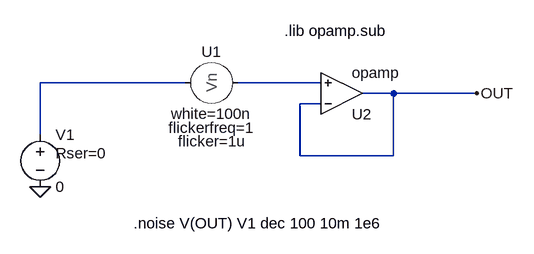
[diagram p0: schematic example_vnoise.asc]
example_vnoise.asc, the LTspice schematic file:
Version 4
SHEET 1 4300 1232
WIRE 1632 -1632 1408 -1632
WIRE 1840 -1632 1712 -1632
WIRE 1952 -1616 1904 -1616
WIRE 2080 -1616 1952 -1616
WIRE 1840 -1600 1808 -1600
WIRE 1408 -1552 1408 -1632
WIRE 1808 -1520 1808 -1600
WIRE 1952 -1520 1952 -1616
WIRE 1952 -1520 1808 -1520
FLAG 1408 -1472 0
FLAG 2080 -1616 OUT
SYMBOL Opamps\\opamp 1872 -1552 M180
SYMATTR InstName U2
SYMBOL voltage 1408 -1568 R0
WINDOW 123 0 0 Left 0
WINDOW 39 24 44 Left 2
SYMATTR SpiceLine Rser=0
SYMATTR InstName V1
SYMATTR Value 0
SYMBOL vnoise 1648 -1632 R90
WINDOW 0 -32 -24 VBottom 2
WINDOW 3 32 -24 VTop 2
WINDOW 123 74 -24 VTop 2
WINDOW 39 53 -24 VTop 2
SYMATTR InstName U1
SYMATTR Value white=100n
SYMATTR Value2 flicker=1u
SYMATTR SpiceLine flickerfreq=1
TEXT 1552 -1416 Left 2 !.noise V(OUT) V1 dec 100 10m 1e6
TEXT 1784 -1712 Left 2 !.lib opamp.sub

The netlist it stands for:
* example_vnoise.asc
XU2 OUT N002 OUT opamp Aol=100K GBW=10Meg  ; pins invin noninvin out
V1 N001 0 0 Rser=0
XU1 N002 N001 vnoise white=100n flicker=1u flickerfreq=1  ; pins P1 P2
.noise V(OUT) V1 dec 100 10m 1e6
.lib opamp.sub
.lib vnoise.sub
.backanno
.end